# EAGLE design 7_MBUS (EAGLE 7.6.0)
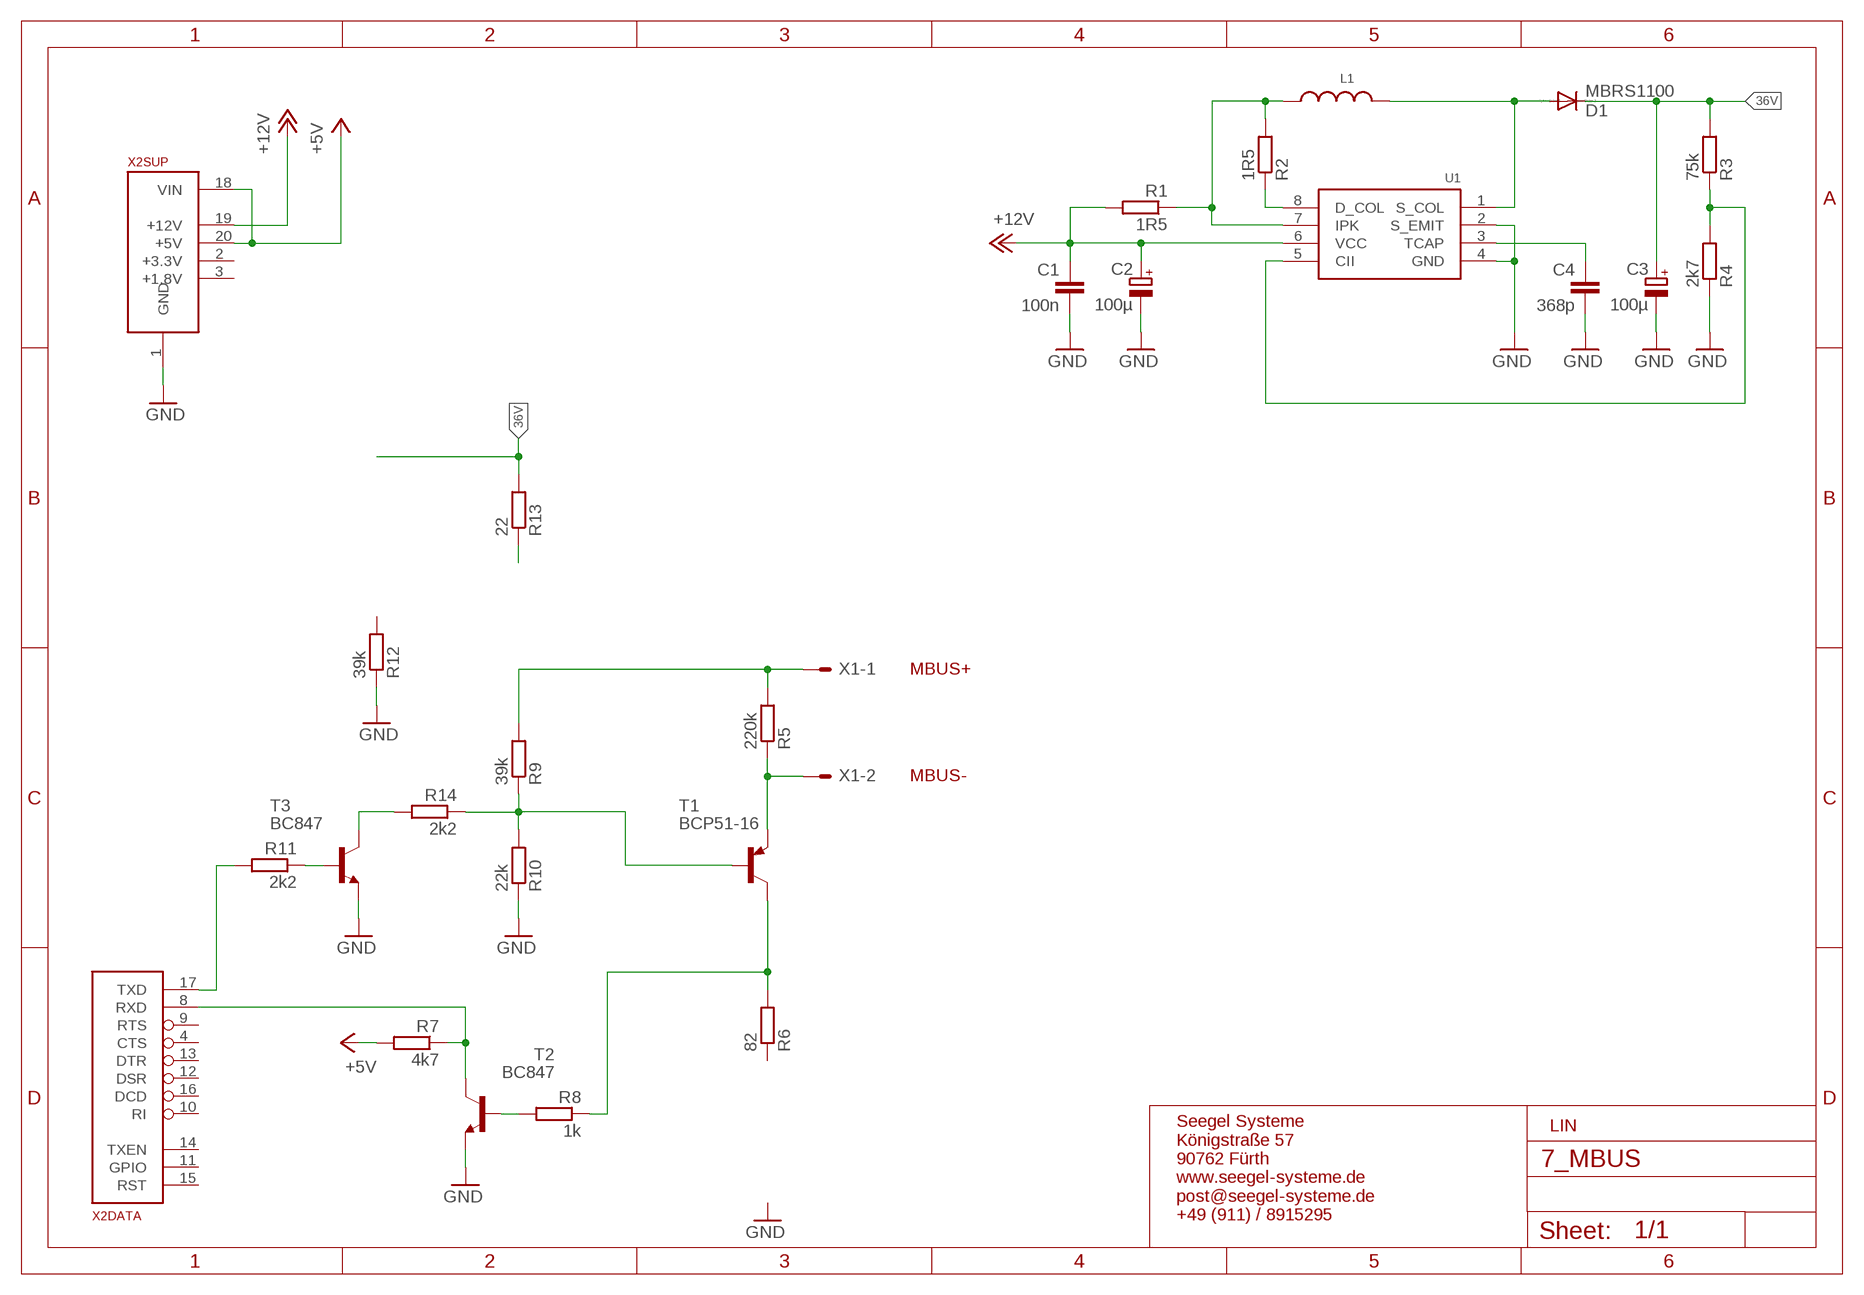
[diagram p0: schematic, sheet 1]

## Parts
C1  100n  C-EUC0805  [C0805]
C2  100µ  CPOL-EUD  [PANASONIC_D]
C3  100µ  CPOL-EUD  [PANASONIC_D]
C4  368p  C-EUC0805  [C0805]
D1  MBRS1100  DIODE-DO214AA  [DO214AA]
L1  WE-PD_1260_74477126  [WE-PD_1260/1245/1280/1210]
R1  1R5  R-EU_R0805  [R0805]
R2  1R5  R-EU_R0805  [R0805]
R3  75k  R-EU_R0805  [R0805]
R4  2k7  R-EU_R0805  [R0805]
R5  220k  R-EU_R0805  [R0805]
R6  82  R-EU_R0805  [R0805]
R7  4k7  R-EU_R0805  [R0805]
R8  1k  R-EU_R0805  [R0805]
R9  39k  R-EU_R0805  [R0805]
R10  22k  R-EU_R0805  [R0805]
R11  2k2  R-EU_R0805  [R0805]
R12  39k  R-EU_R0805  [R0805]
R13  22  R-EU_R0805  [R0805]
R14  2k2  R-EU_R0805  [R0805]
T1  BCP51-16  -PNP-  [SOT223]
T2  BC847  [SOT23]
T3  BC847  [SOT23]
U1  MC34063A  [SOIC8_150MIL]
X1  AKL18X-02W  [AKL182-02]
X2  ALLSERIALSLAVE  [DAUGHTER-THT]

## Nets
36V: C3.+ D1.C R3.2 R13.2
+5V: R7.2 X2.18(SUP:VIN) X2.20(SUP:+5V)
+12V: C1.1 C2.+ R1.2 U1.6(VCC) X2.19(SUP:+12V)
GND: C1.2 C2.- C3.- C4.2 R4.1 R10.1 R12.1 T2.2(E) T3.2(E) U1.2(S_EMIT) U1.4(GND) X2.1(SUP:GND)
N$1: D1.A L1.1 U1.1(S_COL)
N$2: L1.2 R1.1 R2.2 U1.7(IPK)
N$3: R2.1 U1.8(D_COL)
N$4: R6.2 R8.1 T1.2(C) T1.4(C)
N$5: C4.1 U1.3(TCAP)
N$6: R3.1 R4.2 U1.5(CII)
N$7: R5.1 T1.3(E) X1.P$2
N$8: R11.2 X2.17(DATA:TXD)
N$9: R7.1 T2.3(C) X2.8(DATA:RXD)
N$10: R8.2 T2.1(B)
N$11: R13.1
N$12: R9.1 R10.2 R14.1 T1.1(B)
N$13: R11.1 T3.1(B)
N$14: R14.2 T3.3(C)
N$100: R5.2 R9.2 X1.P$1
Unconnected: R6.1 R12.2 X2.2(SUP:+3.3V) X2.3(SUP:+1.8V) X2.4(DATA:CTS) X2.5(USB:D-) X2.6(USB:D+) X2.7(USB:VUSB) X2.9(DATA:RTS) X2.10(DATA:RI) X2.11(DATA:GPIO) X2.12(DATA:DSR) X2.13(DATA:DTR) X2.14(DATA:TXEN) X2.15(DATA:RST) X2.16(DATA:DCD)

## Notes on the sheet
- MBUS+
- MBUS-
- LIN
- Seegel Systeme
  Königstraße 57
  90762 Fürth
  www.seegel-systeme.de
  post@seegel-systeme.de
  +49 (911) / 8915295

## Library data of the parts
C1 C4 = rcl:C-EU: CAPACITOR, European symbol
C2 C3 = rcl:CPOL-EU: POLARIZED CAPACITOR, European symbol
D1 = diode:DIODE-: DIODE
L1 = PowerMagnetics (rev18d):WE-PD_1260: SMD Shielded Power Inductor Characteristics Magnetically shielded version which results in a low leakage field High Saturation currents up to 25 A Very low self-losses at high switching frequency‘s Wide inductances spectrum available at all sizes Operating temperature: –40 °C to +125 °C Applications Perfectly suitable for switching regulators with extremely high efficiency Integrated DC/DC- converter Switching regulators with low operating voltages (Graphic cards, embedded PC-Cards, Mainboards) Plastic base: Because of the one piece construction these are more suitable for high vibration or shock applications <http://katalog.we-online.de/media/images/v2/Family_WE-PD.jpg> Details see: http://katalog.we-online.de/en/pbs/WE-PD? Updated by Dan Xu 2014-07-08 2014 (C) Wurth Elektronik; WE-NUMBER: 74477126/680uH
R1-R14 = rcl:R-EU_: RESISTOR, European symbol
T1 = transistor:*-PNP-: PNP Transistror
T2 T3 = transistor:BC847: NPN TRANSISTOR
U1 = microbuilder:MC34063A: MC34063A - 1.5A 3V-40V Boost/Buck/Inverting Voltage Regulator [Part No.] Allows you to 'boost', reduce or invert the voltage of your power supply to a more appropriate level. Common voltage regulators like the LM1117 are easy to use, but they can only 'reduce' the voltage level and require more volts than they provide, making them useless for low voltage power supplies like batteries or solar panels. A 'Step-Up' regulator like the MC34063A solves this problem by also allowing you to increase the voltage to a pre-determined level, though you still need to pay attention to the minimum voltage level the converter can handle, keeping in mind that many 'step-up' converts are less efficient at the two extreme ends of their working range. Given that many step-up circuits introduce some ripple to the power supply, you can often get a much 'smoother' supply by boosting the voltage up to 5.0V and then using a standard fixed voltage regulator (such as the common LM1117, etc.) to drop the voltage back down to 3.3V. This may not be necessary, and some step up regulators can provide a smooth supply on their own, but it's worth keeping in mind if you do encounter some ripple in the power supply using only a step-up IC for your power supply. Texas Instruments MC34063A Digikey: 296-17765-1-ND
X1 = con-riacon_akl:AKL18X-02: Riacon AKL18X Steckverbinder 2-Pol Grid = 3,5mm
X2 = AllSerialv2:ALLSERIALSLAVE

## Board
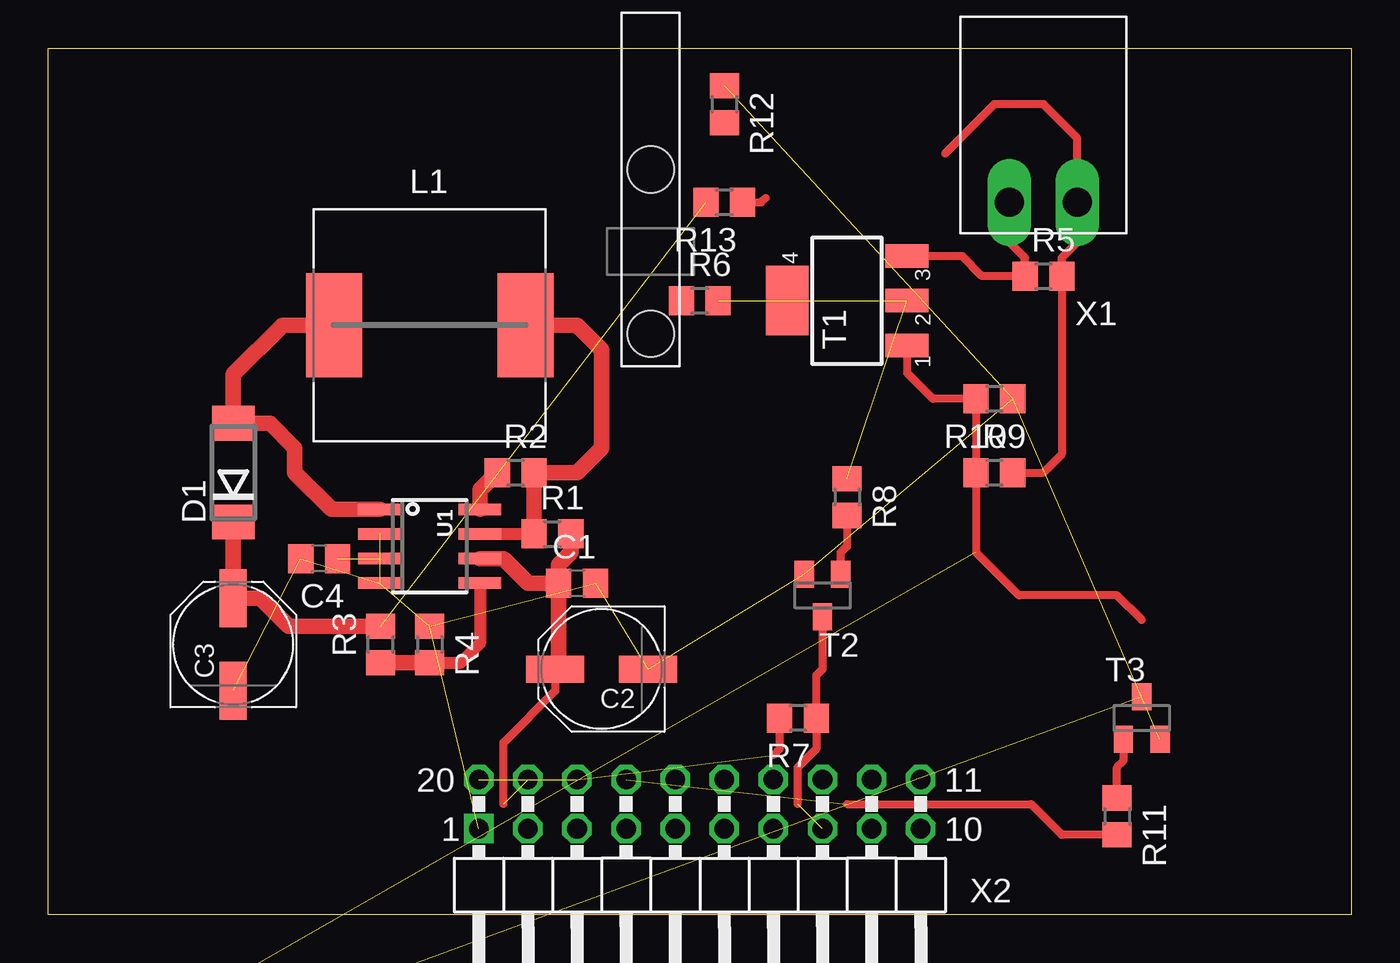
[diagram p1: board, top side]
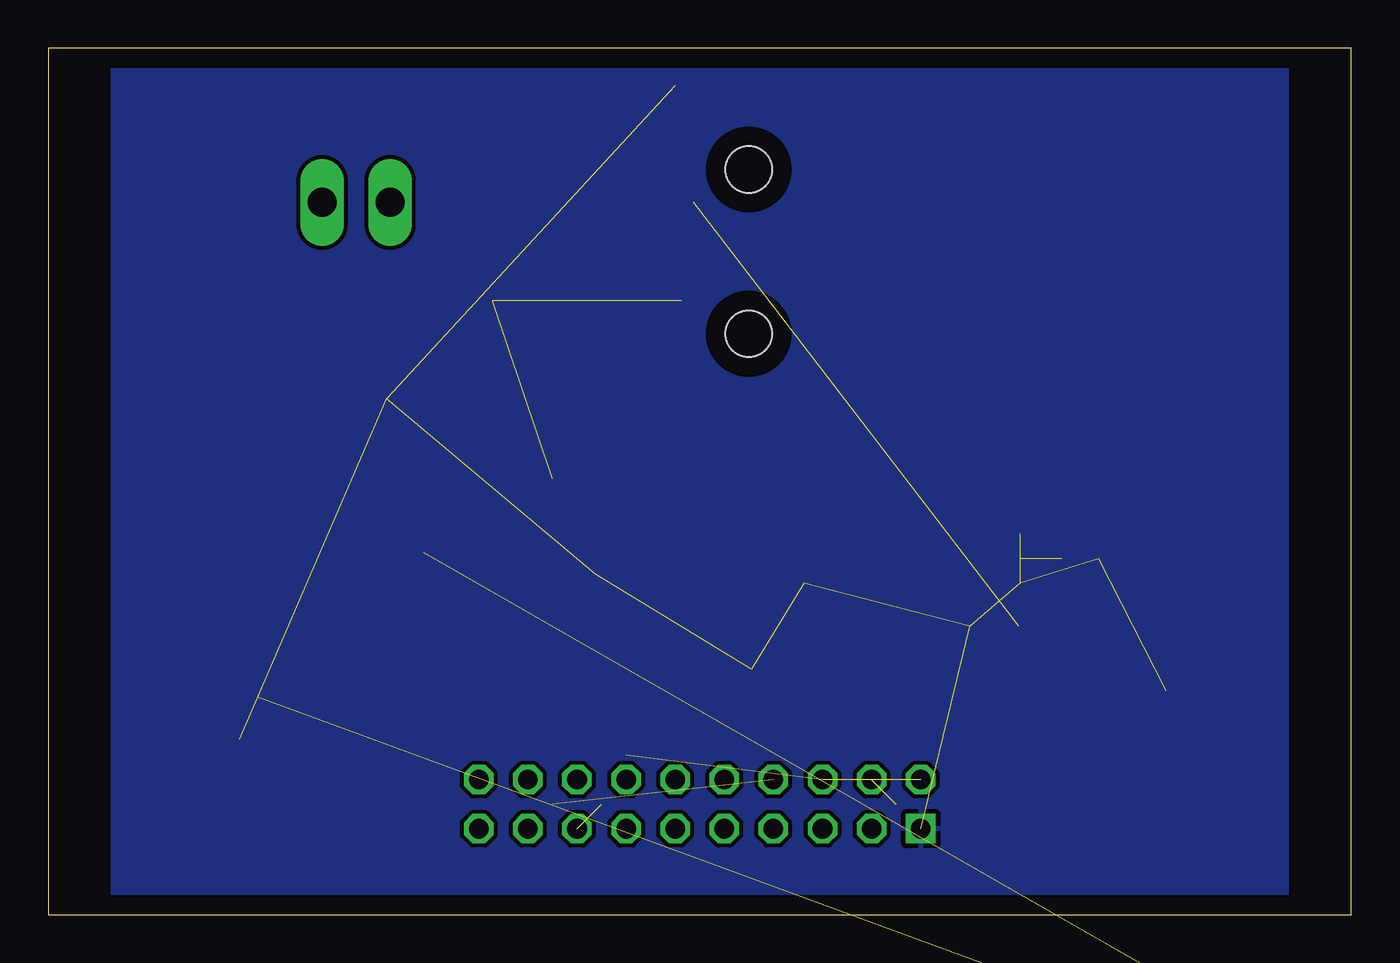
[diagram p2: board, bottom side, seen from below]

Size 67.4 x 44.8 mm. Coordinates in mm from the lower left corner, seen from the top.
Copper layers (1*16): Top 0.035mm / dielectric 1.5mm / Bottom 0.035mm
Design rules "default *": minimum track width 10mil, minimum drill 24mil, track to track 8mil, track to pad 8mil, pad to pad 8mil, via to via 8mil, smd to smd 8mil, copper to edge 40mil, drill to drill 8mil, minimum pad ring 10mil, minimum via ring 8mil, stop-mask expansion 4mil, vias tented up to drill 0.3mm, thermal gap 10mil

### Footprints (pad centres in the part's own frame; a part is rotated, then mirrored left to right if it is on the bottom)
C0805 = smd 1.3 x 1.5: 1 -0.95,0; 2 0.95,0
PANASONIC_D = smd 3 x 1.4: + 2.4,0; - -2.4,0
DO214AA = smd 1.8 x 2.2: A 2.55,0; C -2.55,0
WE-PD_1260/1245/1280/1210 = smd 2.9 x 5.4: 1 -4.95,0; 2 4.95,0
R0805 = smd 1.3 x 1.5: 1 -0.95,0; 2 0.95,0
SOT223 = smd 1.219 x 2.235: 1 -2.311,-3.099; 2 0,-3.099; 3 2.311,-3.099 | smd 3.6 x 2.2: 4 0,3.099
SOT23 = smd 1 x 1.4: 1 -0.95,-1.1; 2 0.95,-1.1; 3 0,1.1
SOIC8_150MIL = smd 0.6 x 2.2: 1 -1.905,-2.6; 2 -0.635,-2.6; 3 0.635,-2.6; 4 1.905,-2.6; 5 1.905,2.6; 6 0.635,2.6; 7 -0.635,2.6; 8 -1.905,2.6
1271.1000 = hole 2.4: 0,-4.25; 0,4.25
AKL182-02 = drill 1.5 pad 2.184 long: P$1 -1.75,0; P$2 1.75,0
DAUGHTER-THT = drill 1.016 square: 1 -11.43,4.445 | drill 1.016 octagon: 2 -8.89,4.445; 3 -6.35,4.445; 4 -3.81,4.445; 5 -1.27,4.445; 6 1.27,4.445; 7 3.81,4.445; 8 6.35,4.445; 9 8.89,4.445; 10 11.43,4.445; 11 11.43,6.985; 12 8.89,6.985; 13 6.35,6.985; 14 3.81,6.985; 15 1.27,6.985; 16 -1.27,6.985; 17 -3.81,6.985; 18 -6.35,6.985; 19 -8.89,6.985; 20 -11.43,6.985

### Placement (x,y rotation side)
C1  27.35,17.14 0 top
C2  28.62,12.7 180 top
C3  9.57,13.97 90 top
C4  14.02,18.41 180 top
D1  9.57,22.86 90 top
L1  19.73,30.48 0 top
R1  26.08,19.68 0 top
R2  24.18,22.86 0 top
R3  17.19,13.97 90 top
R4  19.73,13.97 270 top
R5  51.48,33.02 0 top
R6  33.7,31.75 0 top
R7  38.78,10.16 180 top
R8  41.32,21.59 270 top
R9  48.94,22.86 0 top
R10  48.94,26.67 180 top
R11  55.29,5.08 270 top
R12  34.97,41.91 270 top
R13  34.97,36.83 180 top
R14  0.68,-8.89 0 top  (outside the outline)
T1  41.32,31.75 90 top
T2  40.05,16.51 180 top
T3  56.56,10.16 0 top
U1  19.73,19.05 270 top
U$1  [1271.1000]  31.16,34.29 0 top
X1  51.48,36.83 180 top
X2  33.7,0 0 top

### Tracks (layer width: path | path; a pad name or v marks a point on that pad's centre or on a via)
36V  (1 unrouted)
  Top 0.813: R3.2 12.43,14.92 10.98,16.37 C3.+ D1.C
+5V  (2 unrouted)
  Top 0.406: R7.2 37.83,8.57 37.51,8.26
+12V  (1 unrouted)
  Top 0.406: 23.54,5.71 23.54,8.89 26.22,11.57 C2.+
  Top 0.813: U1.6 23.54,18.41 24.81,17.14 C1.1 | C1.1 26.4,12.88 C2.+ | R1.2 27.03,18.73 26.4,18.1 C1.1
GND  (11 unrouted)
  pour Bottom: -0.59,44.45 67.99,44.45 67.99,0 -0.59,0
N$1
  Top 0.813: U1.1 14.65,20.95 12.75,22.86 12.75,24.13 11.47,25.41 D1.A 9.57,27.94 12.11,30.48 L1.1
N$2
  Top 0.61: U1.7 R1.1
  Top 0.813: L1.2 27.35,30.48 28.62,29.21 28.62,24.13 27.35,22.86 R2.2 R1.1
N$3
  Top 0.813: U1.8 22.33,21.96 R2.1
N$4  (3 unrouted)
N$5  (1 unrouted)
N$6
  Top 0.61: U1.5 22.33,14.03 21.32,13.02 R4.2
  Top 0.813: R4.2 R3.1
N$7
  Top 0.406: T1.3 47.26,34.06 48.31,33.02 R5.1 50.53,33.97 49.73,34.77 X1.P$2
N$8  (1 unrouted)
  Top 0.406: 41.32,5.71 50.84,5.71 52.43,4.13 R11.2
N$9  (1 unrouted)
  Top 0.406: 38.78,5.71 38.78,7.62 39.73,8.57 R7.1 39.73,12.38 40.05,12.7 T2.3
N$10
  Top 0.406: T2.1 41,18.73 41.32,19.05 R8.2
N$11
  Top 0.406: R13.1 36.88,36.83 37.1,37.06
N$12  (1 unrouted)
  Top 0.406: T1.1 44.42,28.02 45.77,26.67 R10.2 R9.1 47.99,18.73 50.21,16.51 55.29,16.51 56.56,15.24
N$13
  Top 0.406: R11.1 55.29,7.62 55.61,7.94 T3.1
N$14  (1 unrouted)
N$100
  Top 0.406: R9.2 51.48,22.86 52.43,23.81 R5.2 52.43,33.97 53.23,34.77 X1.P$1 53.23,40.16 51.48,41.91 48.94,41.91 46.4,39.37